# EAGLE design blink1mk2_v2c6 (EAGLE 6.6.0)
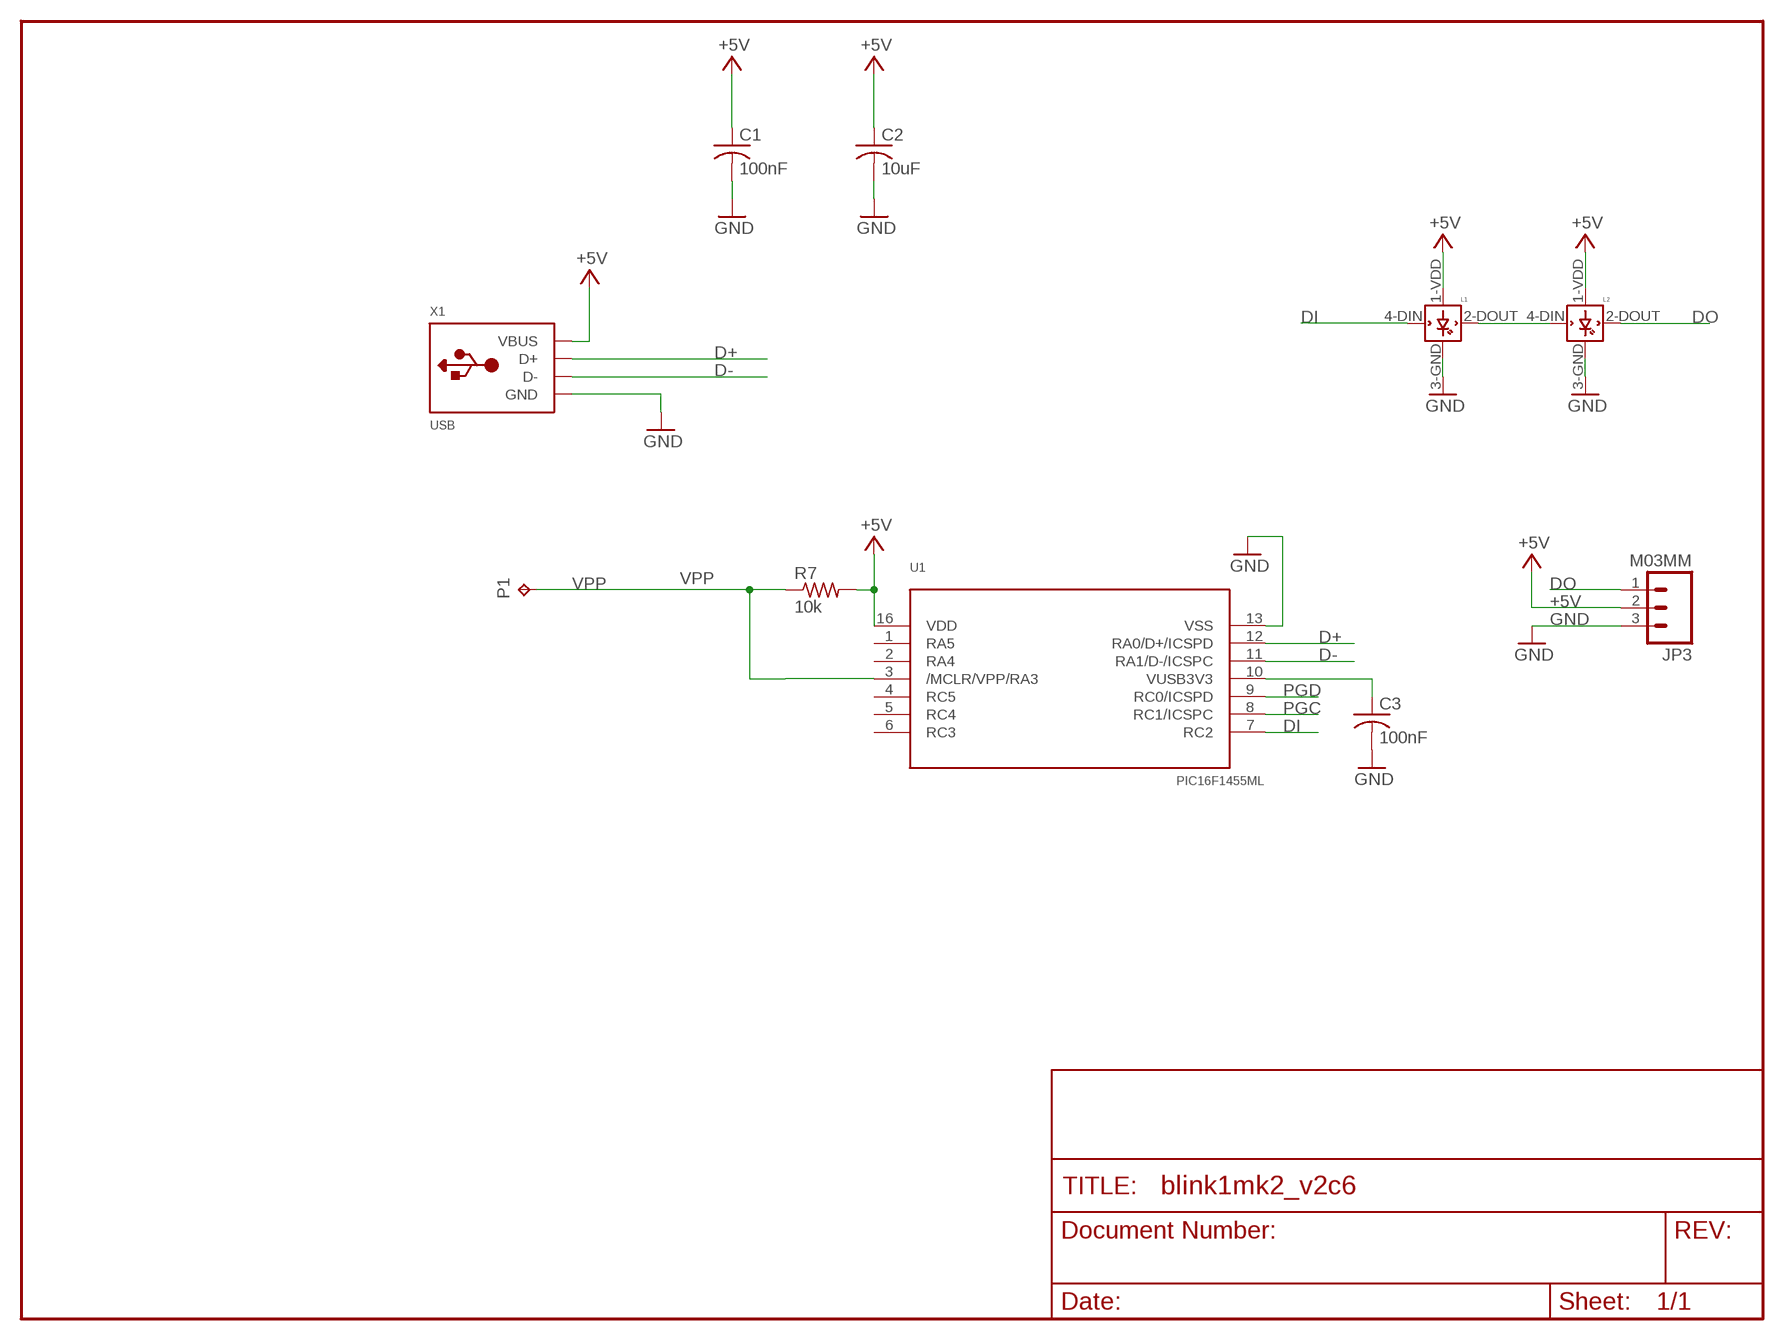
[diagram p0: schematic, sheet 1]

## Parts
C1  100nF  C-USC0603  [C0603]
C2  10uF  C-USC0603  [C0603]
C3  100nF  C-USC0603  [C0603]
JP3  M03MM  [1X03-1.5MM]
L1  WS2812B  [WS2812B]
L2  WS2812B  [WS2812B]
P1  TPTP11SQ  [TP11SQ]
R7  10k  R-US_R0603  [R0603]
U1  PIC16F1455ML  [QFN16_4X4]
X1  USB  [MOLEX-48037-1000]

## Nets
+5V: C1.1 C2.1 JP3.2 L1.1-VDD(VDD) L2.1-VDD(VDD) R7.2 U1.16(VDD) X1.1(VBUS)
D+: U1.12(RA0/D+/ICSPD) X1.3(D+)
D-: U1.11(RA1/D-/ICSPC) X1.2(D-)
DI: L1.4-DIN(DIN) U1.7(RC2)
DO: JP3.1 L2.2-DOUT(DOUT)
GND: C1.2 C2.2 C3.2 JP3.3 L1.3-GND(GND) L2.3-GND(GND) U1.13(VSS) X1.4(GND)
N$2: L1.2-DOUT(DOUT) L2.4-DIN(DIN)
PGC: U1.8(RC1/ICSPC)
PGD: U1.9(RC0/ICSPD)
VPP: P1.TP R7.1 U1.3(/MCLR/VPP/RA3)
VUSB3V3: C3.1 U1.10(VUSB3V3)
Unconnected: U1.1(RA5) U1.2(RA4) U1.4(RC5) U1.5(RC4) U1.6(RC3)

## Library data of the parts
C1-C3 = rcl:C-US: CAPACITOR, American symbol
JP3 = todstuff:M03
L1 L2 = adafruit:WS2812B
P1 = testpad:TP: Test pad
R7 = rcl:R-US_: RESISTOR, American symbol
U1 = todstuffnew:PIC16F1455
X1 = todstuff:USB

## Board
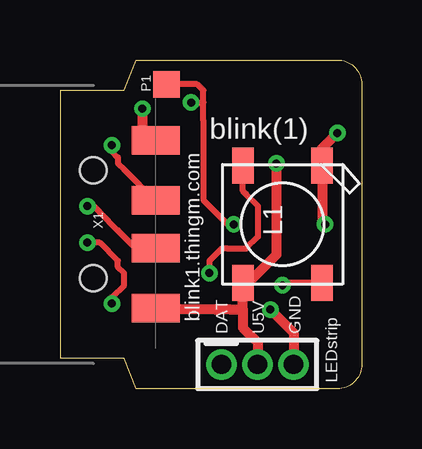
[diagram p1: board, top side]
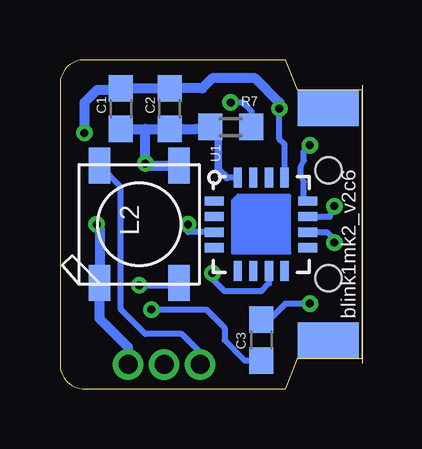
[diagram p2: board, bottom side, seen from below]

Size 12.57 x 13.72 mm. Coordinates in mm from the lower left corner, seen from the top.
Outline: 0,12.45 2.67,12.45 3.17,13.72 11.56,13.72 arc-90 12.57,12.7 12.57,1.02 arc-90 11.56,0 3.17,0 2.67,1.27 0,1.27 0,12.45
Copper layers (1*16): Top 0.0356mm / dielectric 1.5011mm / Bottom 0.0356mm
Design rules "LaenPCBOrder *": minimum track width 10mil, minimum drill 13mil, track to track 6mil, track to pad 8mil, pad to pad 8mil, via to via 8mil, smd to smd 6mil, copper to edge 15mil, drill to drill 8mil, minimum pad ring 7mil, minimum via ring 7mil, stop-mask expansion 4mil, vias tented up to drill 25mil, thermal gap 10mil

### Footprints (pad centres in the part's own frame; a part is rotated, then mirrored left to right if it is on the bottom)
C0603 = smd 1.1 x 1: 1 -0.85,0; 2 0.85,0
1X03-1.5MM = drill 0.8 pad 1.27: 1 0,0; 2 1.5,0; 3 3,0
WS2812B = smd 1.5 x 0.9: 1-VDD 2.45,-1.65; 2-DOUT 2.45,1.65; 3-GND -2.45,1.65; 4-DIN -2.45,-1.65
TP11SQ = smd 1.1 x 1.1: TP 0,0
R0603 = smd 1 x 1.1: 1 -0.85,0; 2 0.85,0
QFN16_4X4 = smd 0.8 x 0.35: 1 -1.95,0.975; 2 -1.95,0.325; 3 -1.95,-0.325; 4 -1.95,-0.975; 9 1.95,-0.975; 10 1.95,-0.325; 11 1.95,0.325; 12 1.95,0.975 | smd 0.35 x 0.8: 5 -0.975,-1.95; 6 -0.325,-1.95; 7 0.325,-1.95; 8 0.975,-1.95; 13 0.975,1.95; 14 0.325,1.95; 15 -0.325,1.95; 16 -0.975,1.95
MOLEX-48037-1000 = smd 2 x 1.2: 1 2.6,-3.5; 2 2.6,-1; 3 2.6,1; 4 2.6,3.5 | smd 2.54 x 1.524 bottom: P$1 0,4.85; P$2 0,-4.85 | hole 1.1: 0,2.25; 0,-2.25

### Placement (x,y rotation side)
C1  10.03,11.68 90 bottom
C2  8,11.68 90 bottom
C3  4.19,2.03 270 bottom
JP3  6.73,1.02 0 top
L1  9.27,6.86 270 top
L2  9.27,6.86 90 bottom
P1  4.45,12.7 0 top
R7  5.46,10.92 180 bottom
U1  4.19,6.86 0 bottom
X1  1.39,6.86 0 top

### Tracks (layer width: path | path; a pad name or v marks a point on that pad's centre or on a via)
+5V  (via drill 0.33)
  Top 0.254: 4.19,3.3 X1.1
  Top 0.406: 6.48,3.3 4.19,3.3 | 7.11,3.3 6.48,3.3 | 7.11,3.3 6.48,3.3 | JP3.2 8.23,1.93 7.62,2.54 7.62,3.3 | 7.11,3.3 7.62,3.3 | 7.62,3.3 L1.1-VDD 7.84,4.41 9.02,5.59 v9.02,9.4
  Bottom 0.254: 10.29,11.18 C1.1 | U1.16 5.63,8.81 | 7.75,9.43 L2.1-VDD
  Bottom 0.305: R7.2 5.97,10.58 5.97,9.91 5.97,9.14 5.63,8.81
  Bottom 0.406: C1.1 9.02,10.83 | 9.02,10.83 C2.1 7.49,10.83 6.91,10.83 R7.2 | L2.1-VDD 8.93,9.31 v9.02,9.4 9.02,10.83
D+  (via drill 0.33)
  Top 0.254: v2.16,10.16 2.16,9.91 2.41,9.65 2.41,9.4 2.67,9.14 3.95,7.86 X1.3
  Bottom 0.254: U1.12 2.41,7.83 2.41,8.64 2.54,8.89 2.54,9.27 2.41,9.53 2.41,9.91 | 2.41,9.91 v2.16,10.16 2.41,9.91
D-  (via drill 0.33)
  Top 0.254: v1.14,7.62 1.4,7.62 1.65,7.37 2.41,6.6 3.16,5.86 X1.2
  Bottom 0.254: U1.11 1.33,7.18 v1.14,7.62
DI  (via drill 0.33)
  Top 0.254: L1.4-DIN 7.62,8.25 7.75,8.13 8.25,7.62 8.25,7.37 8.25,6.35 7.75,5.84 6.99,5.84 6.73,5.84 6.48,5.59 6.22,5.33 v6.22,4.83
  Bottom 0.254: U1.7 3.87,4.39 4.19,4.06 5.71,4.06 6.22,4.57 v6.22,4.83
DO
  Bottom 0.254: L2.2-DOUT 10.03,8.42 10.03,3.3 9.02,2.29 7.49,2.29 6.73,1.52 JP3.1
GND  (via drill 0.33)
  Top 0.254: 3.43,10.92 3.94,10.41 X1.4
  Top 0.305: 10.92,6.99 v11.05,6.86
  Top 0.406: v3.43,11.68 3.43,10.92 | 10.92,6.99 L1.3-GND 10.92,10.03 v11.56,10.67 | v8.76,3.3 9.73,2.33 JP3.3
  Bottom 0.254: 10.29,12.45 C1.2 | U1.13 3.22,10.2 3.43,10.41 v3.43,11.68 | C3.2 4.87,1.18 5.71,2.03 5.71,2.54 6.48,3.3 v8.76,3.3
  Bottom 0.305: v11.05,6.86 10.92,6.73
  Bottom 0.406: 3.43,11.94 v3.43,11.68 3.43,11.94 | 3.43,11.94 4.45,12.95 6.22,12.95 6.64,12.53 C2.2 C1.2 | 10.29,12.45 11.05,12.45 11.56,11.94 v11.56,10.67 | 10.92,6.73 L2.3-GND 10.92,2.92 10.79,2.79 9.73,1.73 JP3.3
N$2  (via drill 0.33)
  Top 0.254: L1.2-DOUT 9.36,4.41 v9.27,4.32
  Bottom 0.254: v9.27,4.32 7.71,4.32 L2.4-DIN
VPP  (via drill 0.33)
  Top 0.254: P1.TP 5.71,12.7 5.97,12.45 5.97,11.94 | 5.97,11.94 5.97,11.18 5.97,7.87 6.99,6.86 v7.24,6.86 | v5.46,11.94 5.97,11.94
  Bottom 0.254: v5.46,11.94 4.95,11.94 4.61,11.6 R7.1 | U1.3 7.24,6.53 v7.24,6.86
VUSB3V3  (via drill 0.33)
  Top 0.254: v1.14,6.1 1.65,6.1 2.41,5.33 2.41,5.08 2.67,4.83 2.67,4.32 2.16,3.81 v2.16,3.56
  Bottom 0.254: U1.10 1.47,6.53 1.14,6.21 v1.14,6.1 | C3.1 3.85,2.88 3.68,3.05 3.17,3.56 v2.16,3.56

### Text on the board
tPlace: blink(1) | blink1.thingm.com | DAT | U5V | GND | LEDstrip
bPlace: blink1mk2_v2c6